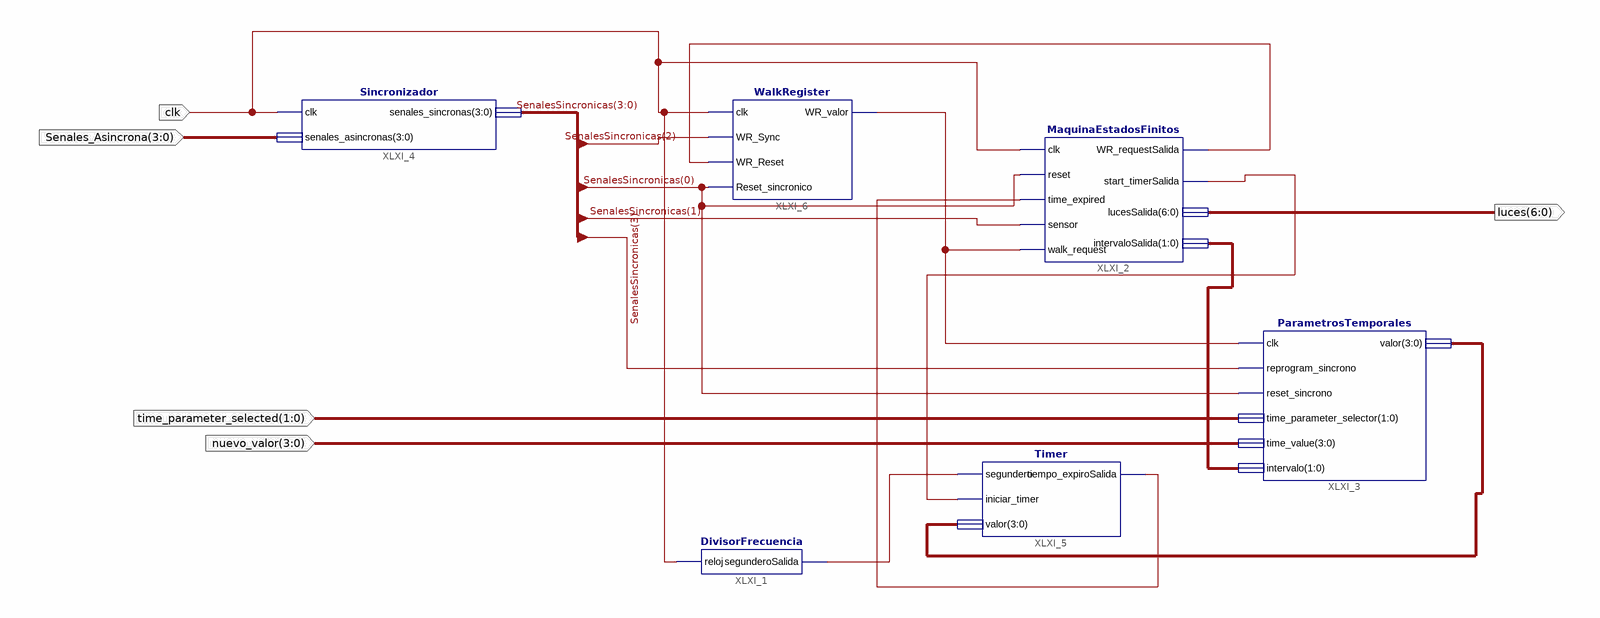
[diagram p0: schematic sheet 1]
// Xilinx ISE schematic Modulo_Completo.sch (spartan3) as structural Verilog: 6 symbols, 5 ports
module Modulo_Completo (
  input  [3:0] nuevo_valor,
  input  [1:0] time_parameter_selected,
  input  clk,
  input  [3:0] Senales_Asincrona,
  output [6:0] luces
);

  wire XLXN_5, XLXN_14, XLXN_16, XLXN_21, XLXN_39;
  wire [1:0] XLXN_8;
  wire [3:0] SenalesSincronicas, XLXN_12;

  DivisorFrecuencia XLXI_1 (.reloj(clk), .segunderoSalida(XLXN_16));
  MaquinaEstadosFinitos XLXI_2 (
    .clk(clk), .reset(SenalesSincronicas[0]), .time_expired(XLXN_21), .sensor(SenalesSincronicas[1]),
    .walk_request(XLXN_5), .WR_requestSalida(XLXN_39), .start_timerSalida(XLXN_14), .lucesSalida(luces),
    .intervaloSalida(XLXN_8));
  ParametrosTemporales XLXI_3 (
    .clk(XLXN_5), .reprogram_sincrono(SenalesSincronicas[3]), .reset_sincrono(SenalesSincronicas[0]),
    .time_parameter_selector(time_parameter_selected), .time_value(nuevo_valor), .intervalo(XLXN_8),
    .valor(XLXN_12));
  Sincronizador XLXI_4 (.clk(clk), .senales_asincronas(Senales_Asincrona), .senales_sincronas(SenalesSincronicas));
  WalkRegister XLXI_6 (
    .clk(clk), .WR_Sync(SenalesSincronicas[2]), .WR_Reset(XLXN_39), .Reset_sincronico(SenalesSincronicas[0]),
    .WR_valor(XLXN_5));
  Timer XLXI_5 (.segundero(XLXN_16), .iniciar_timer(XLXN_14), .valor(XLXN_12), .tiempo_expiroSalida(XLXN_21));
endmodule
